# EAGLE design PoE_Atmega (EAGLE 8.3.1)
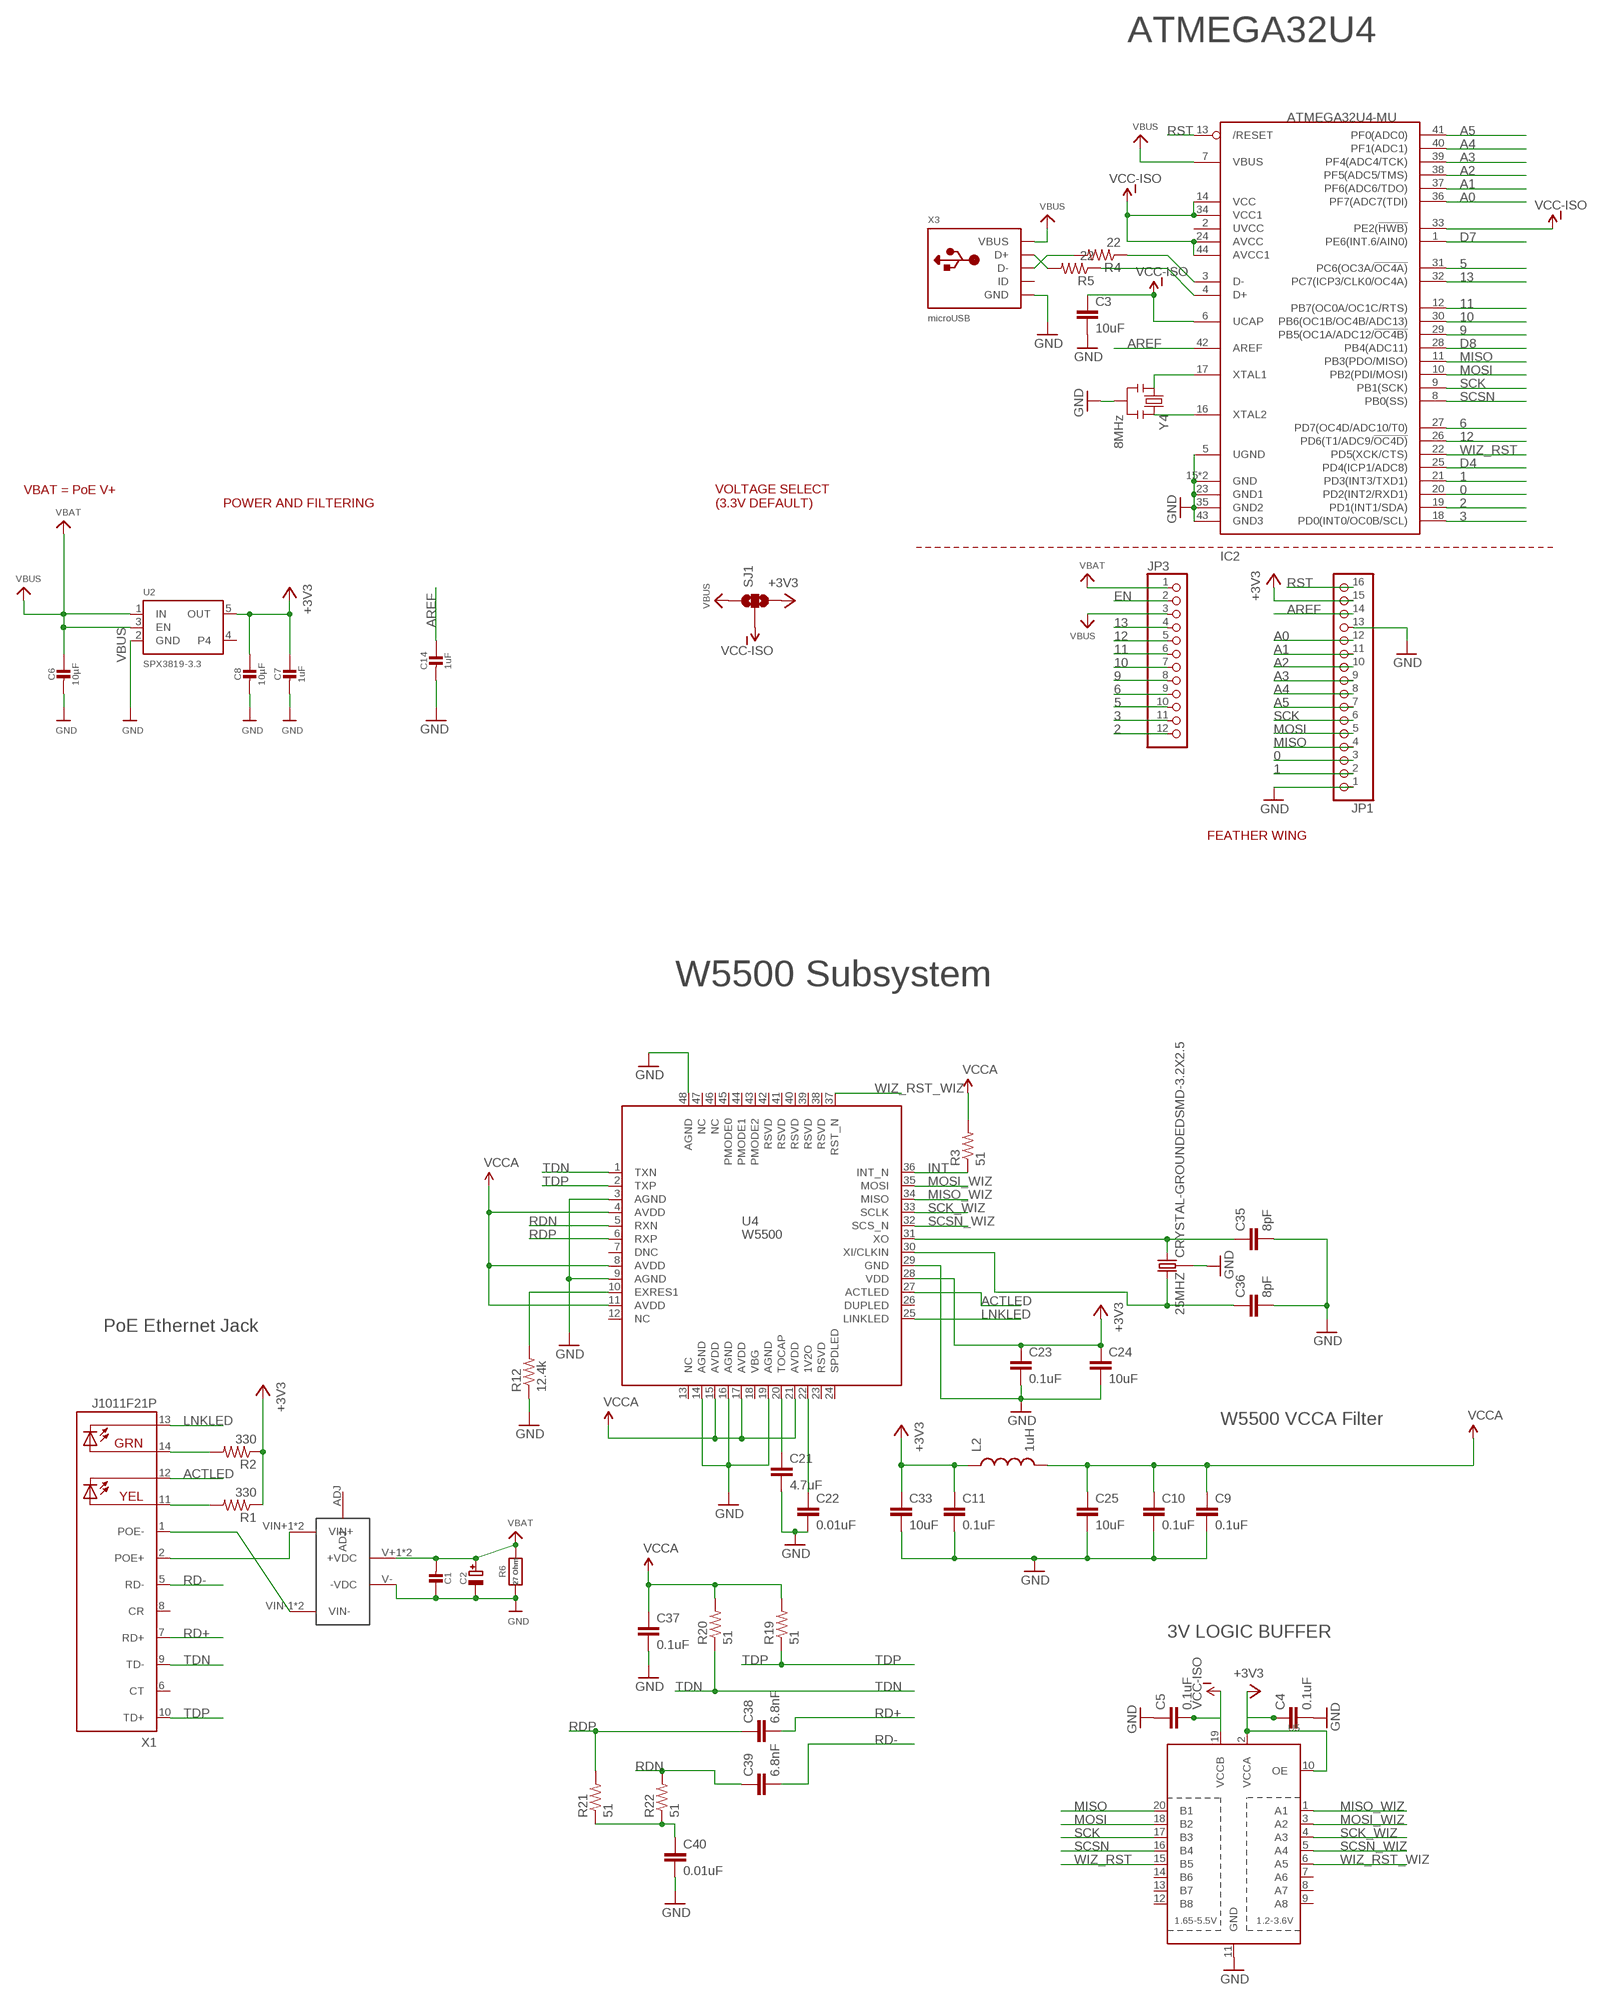
[diagram p0: schematic, sheet 1, part 1 of 2]
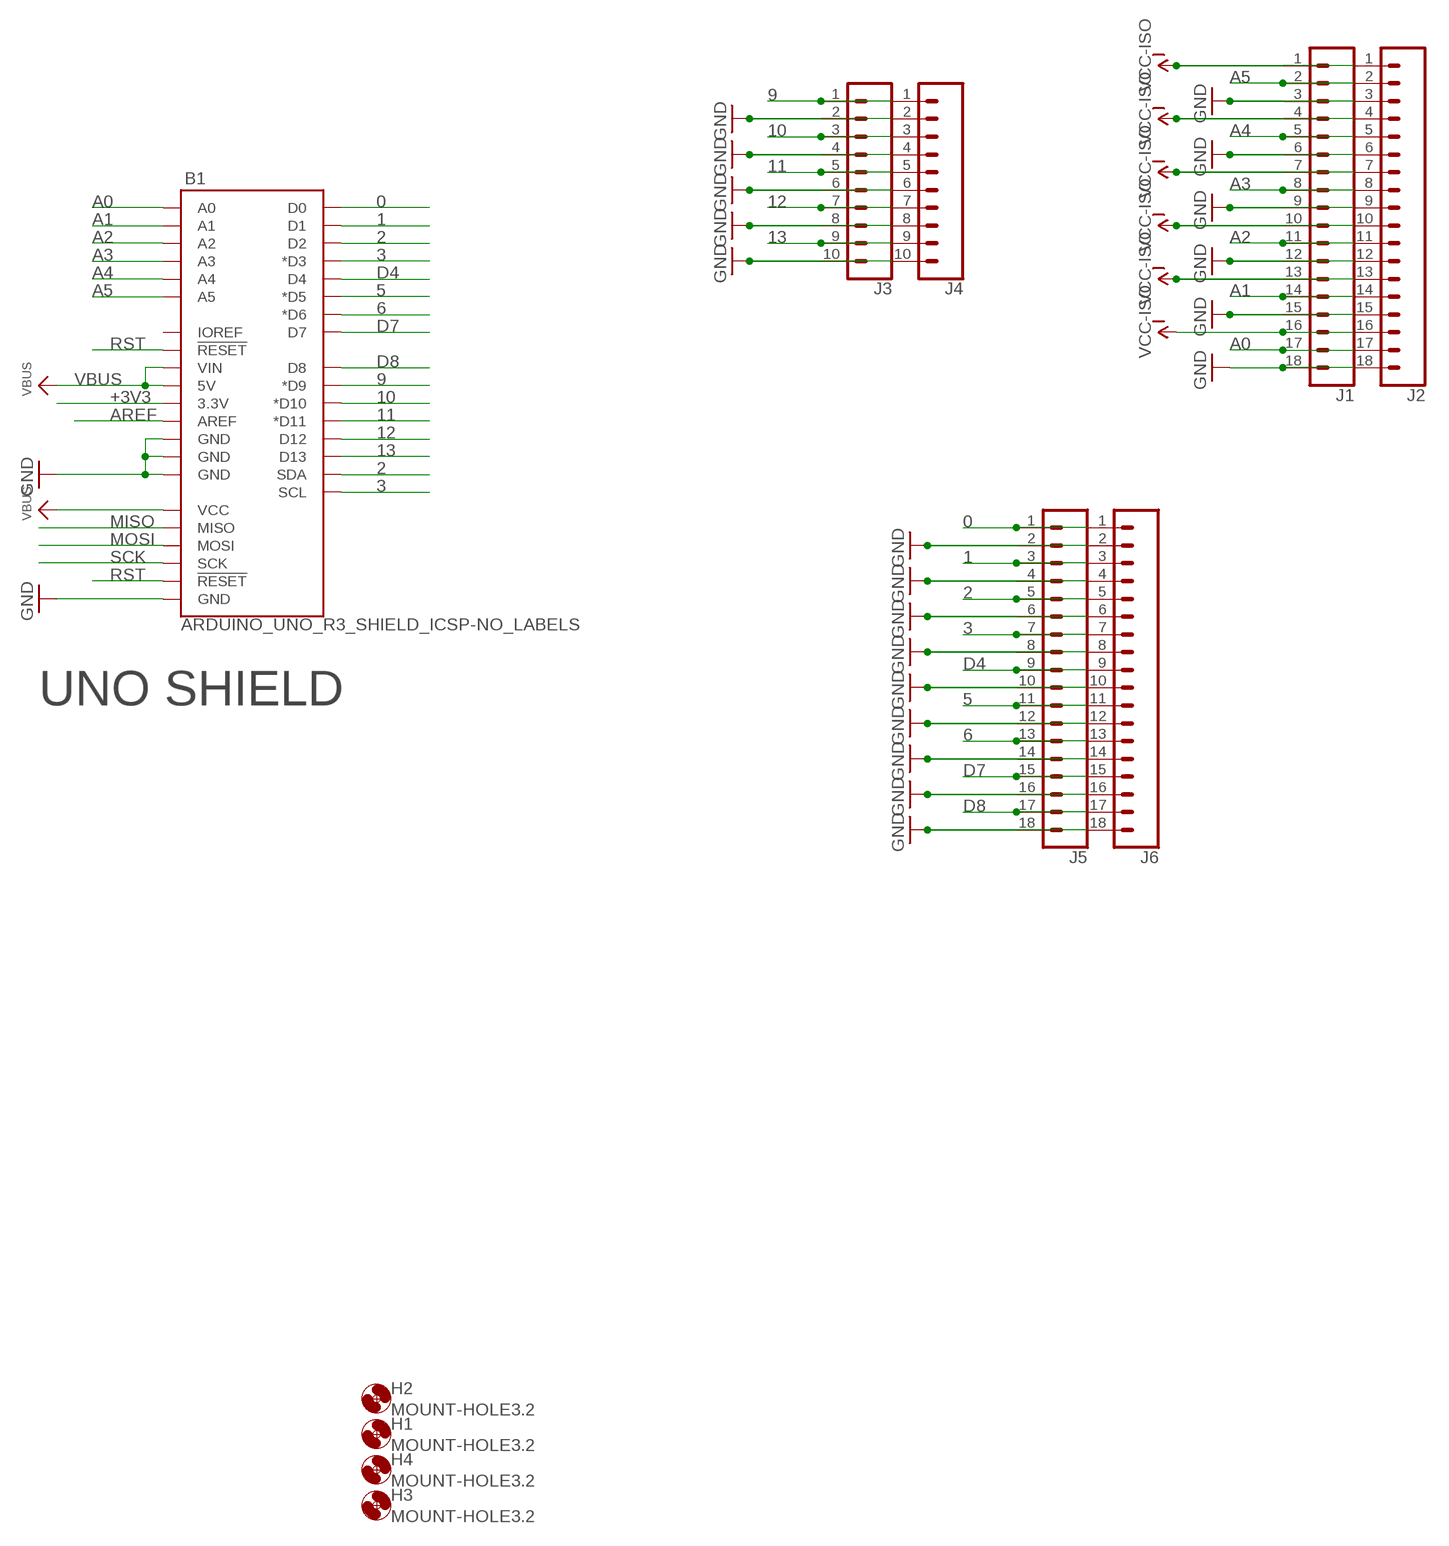
[diagram p1: schematic, sheet 1, part 2 of 2]

## Parts
25MHZ  CRYSTAL-GROUNDEDSMD-3.2X2.5  [CRYSTAL-SMD-3.2X2.5MM]
B1  ARDUINO_UNO_R3_SHIELD_ICSP-NO_LABELS  [UNO_R3_SHIELD_ICSP_NOLABELS]
C1  CAP_CERAMIC_0805MP  [_0805MP]
C2  CAP_ELECTROLYTICPANASONIC_C  [PANASONIC_C]
C3  10uF  CAP0603-CAP  [0603-CAP]
C4  0.1uF  CAP0603-CAP  [0603-CAP]
C5  0.1uF  CAP0603-CAP  [0603-CAP]
C6  10µF  CAP_CERAMIC0603MINI  [0603-MINI]
C7  1uF  CAP_CERAMIC0603MINI  [0603-MINI]
C8  10µF  CAP_CERAMIC0603MINI  [0603-MINI]
C9  0.1uF  CAP0603-CAP  [0603-CAP]
C10  0.1uF  CAP0603-CAP  [0603-CAP]
C11  0.1uF  CAP0603-CAP  [0603-CAP]
C14  1uF  CAP_CERAMIC0603_NO  [0603-NO]
C21  4.7uF  CAP0603-CAP  [0603-CAP]
C22  0.01uF  CAP0603-CAP  [0603-CAP]
C23  0.1uF  CAP0603-CAP  [0603-CAP]
C24  10uF  CAP0603-CAP  [0603-CAP]
C25  10uF  CAP0603-CAP  [0603-CAP]
C33  10uF  CAP0603-CAP  [0603-CAP]
C35  8pF  CAP0603-CAP  [0603-CAP]
C36  8pF  CAP0603-CAP  [0603-CAP]
C37  0.1uF  CAP0603-CAP  [0603-CAP]
C38  6.8nF  CAP0603-CAP  [0603-CAP]
C39  6.8nF  CAP0603-CAP  [0603-CAP]
C40  0.01uF  CAP0603-CAP  [0603-CAP]
H1  MOUNT-HOLE3.2  [3,2]
H2  MOUNT-HOLE3.2  [3,2]
H3  MOUNT-HOLE3.2  [3,2]
H4  MOUNT-HOLE3.2  [3,2]
IC2  ATMEGA32U4-MU  [TQFN44_7MM]
J1  CONN_18  [1X18]
J2  CONN_18  [1X18]
J3  CONN_10"  [1X10]
J4  CONN_10"  [1X10]
J5  CONN_18  [1X18]
J6  CONN_18  [1X18]
JP1  HEADER-1X16ROUND  [1X16_ROUND]
JP3  HEADER-1X12  [1X12_ROUND]
L2  1uH  INDUCTOR0603  [0603]
R1  330  RESISTOR0603-RES  [0603-RES]
R2  330  RESISTOR0603-RES  [0603-RES]
R3  51  RESISTOR0603-RES  [0603-RES]
R4  22  RESISTOR0603-RES  [0603-RES]
R5  22  RESISTOR0603-RES  [0603-RES]
R6  27 Ohm  RESISTOR2512  [2512]
R12  12.4k  RESISTOR0603-RES  [0603-RES]
R19  51  RESISTOR0603-RES  [0603-RES]
R20  51  RESISTOR0603-RES  [0603-RES]
R21  51  RESISTOR0603-RES  [0603-RES]
R22  51  RESISTOR0603-RES  [0603-RES]
SJ1  SOLDERJUMPER_2WAYPASTE2&3  [SJ_3_PASTE2&3]
U2  SPX3819-3.3  VREG_SOT23-5  [SOT23-5]
U4  W5500  [W5500]
U5  TXB0108PWR  [TSSOP20]
U$1  SILVERTEL_POEMICRO  [AG9900]
X1  J1011F21P  [J1]
X3  microUSB  USB_MICRO_20329_V2  [4UCONN_20329_V2]
Y4  8MHz  RESONATORSMD  [RESONATOR-SMD]

## Nets
0: B1.RX(D0) IC2.20(PD2(INT2/RXD1)) J5.1 J6.1 JP1.3
1: B1.TX(D1) IC2.21(PD3(INT3/TXD1)) J5.3 J6.3 JP1.2
2: B1.D2 B1.SDA IC2.19(PD1(INT1/SDA)) J5.5 J6.5 JP3.12
3: B1.D3(*D3) B1.SCL IC2.18(PD0(INT0/OC0B/SCL)) J5.7 J6.7 JP3.11
5: B1.D5(*D5) IC2.31(PC6(OC3A/!OC4A)) J5.11 J6.11 JP3.10
6: B1.D6(*D6) IC2.27(PD7(OC4D/ADC10/T0)) J5.13 J6.13 JP3.9
9: B1.D9(*D9) IC2.29(PB5(OC1A/ADC12/!OC4B)) J3.1 J4.1 JP3.8
10: B1.D10(*D10) IC2.30(PB6(OC1B/OC4B/ADC13)) J3.3 J4.3 JP3.7
11: B1.D11(*D11) IC2.12(PB7(OC0A/OC1C/RTS)) J3.5 J4.5 JP3.6
12: B1.D12 IC2.26(PD6(T1/ADC9/!OC4D)) J3.7 J4.7 JP3.5
13: B1.D13 IC2.32(PC7(ICP3/CLK0/OC4A)) J3.9 J4.9 JP3.4
+3V3: B1.3.3V C4.1 C7.1 C8.1 C11.1 C23.1 C24.1 C33.1 JP1.15 L2.1 R1.1 R2.1 SJ1.3 U2.5(OUT) U4.28(VDD) U5.2(VCCA) U5.10(OE)
A0: B1.A0 IC2.36(PF7(ADC7(TDI)) J1.17 J2.17 JP1.12
A1: B1.A1 IC2.37(PF6(ADC6/TDO)) J1.14 J2.14 JP1.11
A2: B1.A2 IC2.38(PF5(ADC5/TMS)) J1.11 J2.11 JP1.10
A3: B1.A3 IC2.39(PF4(ADC4/TCK)) J1.8 J2.8 JP1.9
A4: B1.A4 IC2.40(PF1(ADC1)) J1.5 J2.5 JP1.8
A5: B1.A5 IC2.41(PF0(ADC0)) J1.2 J2.2 JP1.7
ACTLED: U4.27(ACTLED) X1.12(YEL-C)
AREF: B1.AREF C14.1 IC2.42(AREF) JP1.14
D4: B1.D4 IC2.25(PD4(ICP1/ADC8)) J5.9 J6.9
D7: B1.D7 IC2.1(PE6(INT.6/AIN0)) J5.15 J6.15
D8: B1.D8 IC2.28(PB4(ADC11)) J5.17 J6.17
D+: IC2.4(D+) R5.1
D-: IC2.3(D-) R4.1
EN: JP3.2
GND: 25MHZ.2 25MHZ.4 B1.GND@0(GND) B1.GND@1(GND) B1.GND@2(GND) B1.GND_ICSP(GND) C1.1 C2.- C3.2 C4.2 C5.1 C6.2 C7.2 C8.2 C9.2 C10.2 C11.2 C14.2 C21.2 C22.2 C23.2 C24.2 C25.2 C33.2 C35.2 C36.2 C37.2 C40.2 IC2.5(UGND) IC2.15(GND) IC2.23(GND1) IC2.35(GND2) IC2.43(GND3) IC2.THERMAL(GND) J1.3 J1.6 J1.9 J1.12 J1.15 J1.18 J2.3 J2.6 J2.9 J2.12 J2.15 J2.18 J3.2 J3.4 J3.6 J3.8 J3.10 J4.2 J4.4 J4.6 J4.8 J4.10 J5.2 J5.4 J5.6 J5.8 J5.10 J5.12 J5.14 J5.16 J5.18 J6.2 J6.4 J6.6 J6.8 J6.10 J6.12 J6.14 J6.16 J6.18 JP1.1 JP1.13 R6.1 R12.1 U2.2(GND) U4.3(AGND) U4.9(AGND) U4.14(AGND) U4.16(AGND) U4.19(AGND) U4.29(GND) U4.48(AGND) U5.11(GND) U$1.V-(-VDC) X3.BASE@1(GND) X3.BASE@2(GND) X3.GND X3.SPRT@1(GND) X3.SPRT@2(GND) X3.SPRT@3(GND) X3.SPRT@4(GND) Y4.2
INT: R3.1 U4.36(INT_N)
LNKLED: U4.25(LINKLED) X1.13(GRN-C)
MISO: B1.MISO IC2.11(PB3(PDO/MISO)) JP1.4 U5.20(B1)
MISO_WIZ: U4.34(MISO) U5.1(A1)
MOSI: B1.MOSI IC2.10(PB2(PDI/MOSI)) JP1.5 U5.18(B2)
MOSI_WIZ: U4.35(MOSI) U5.3(A2)
N$1: U$1.VIN-1(VIN-) U$1.VIN-2(VIN-) X1.1(POE-)
N$2: U$1.VIN+1(VIN+) U$1.VIN+2(VIN+) X1.2(POE+)
N$6: R5.2 X3.D+
N$9: R1.2 X1.11(YEL-A)
N$10: R2.2 X1.14(GRN-A)
N$11: IC2.16(XTAL2) Y4.3
N$12: IC2.17(XTAL1) Y4.1
N$13: R4.2 X3.D-
N$18: C21.1 U4.20(TOCAP)
N$19: C22.1 U4.22(1V2O)
N$20: R12.2 U4.10(EXRES1)
N$23: C40.1 R21.1 R22.1
N$25: 25MHZ.3 C35.1 U4.31(XO)
N$26: 25MHZ.1 C36.1 U4.30(XI/CLKIN)
RD+: C38.2 X1.7(RD+)
RD-: C39.2 X1.5(RD-)
RDN: C39.1 R22.2 U4.5(RXN)
RDP: C38.1 R21.2 U4.6(RXP)
RST: B1.RES(!RESET!) B1.RST_ICSP(!RESET!) IC2.13(/RESET) JP1.16
SCK: B1.SCK IC2.9(PB1(SCK)) JP1.6 U5.17(B3)
SCK_WIZ: U4.33(SCLK) U5.4(A3)
SCSN: IC2.8(PB0(SS)) U5.16(B4)
SCSN_WIZ: U4.32(SCS_N) U5.5(A4)
TDN: R20.1 U4.1(TXN) X1.9(TD-)
TDP: R19.1 U4.2(TXP) X1.10(TD+)
VBAT: JP3.1
VBUS: B1.5V B1.5V_ICSP(VCC) B1.VIN C1.2 C2.+ C6.1 IC2.7(VBUS) JP3.3 R6.2 SJ1.1 U2.1(IN) U2.3(EN) U$1.V+1(+VDC) U$1.V+2(+VDC) X3.VBUS ; supply symbol labelled VBAT
VCC-ISO: C3.1 C5.2 IC2.6(UCAP) IC2.14(VCC) IC2.24(AVCC) IC2.33(PE2(!HWB)) IC2.34(VCC1) IC2.44(AVCC1) J1.1 J1.4 J1.7 J1.10 J1.13 J1.16 J2.1 J2.4 J2.7 J2.10 J2.13 J2.16 SJ1.2 U5.19(VCCB)
VCCA: C9.1 C10.1 C25.1 C37.1 L2.2 R3.2 R19.2 R20.2 U4.4(AVDD) U4.8(AVDD) U4.11(AVDD) U4.15(AVDD) U4.17(AVDD) U4.21(AVDD)
WIZ_RST: IC2.22(PD5(XCK/CTS)) U5.15(B5)
WIZ_RST_WIZ: U4.37(RST_N) U5.6(A5)
Unconnected: B1.IOREF IC2.2(UVCC) U2.4 U4.7(DNC) U4.12(NC) U4.13(NC) U4.18(VBG) U4.23(RSVD) U4.24(SPDLED) U4.26(DUPLED) U4.38(RSVD) U4.39(RSVD) U4.40(RSVD) U4.41(RSVD) U4.42(RSVD) U4.43(PMODE2) U4.44(PMODE1) U4.45(PMODE0) U4.46(NC) U4.47(NC) U5.7(A6) U5.8(A7) U5.9(A8) U5.12(B8) U5.13(B7) U5.14(B6) U$1.ADJ X1.6(CT) X1.8(CR) X3.ID

## Notes on the sheet
- ATMEGA32U4
- VBAT = PoE V+
- POWER AND FILTERING
- VOLTAGE SELECT
  (3.3V DEFAULT)
- UNO SHIELD
- FEATHER WING
- W5500 Subsystem
- PoE Ethernet Jack
- W5500 VCCA Filter
- 3V LOGIC BUFFER

## Library data of the parts
25MHZ = SparkFun-Clocks:CRYSTAL-GROUNDED: Crystals w/ Ground Pin (Generic) These are passive quartz crystals, which can be used as a clock source for a microcontroller. Crystal's are usually two-terminal devices. A third terminal may be optionally connected to ground, as recommended by the manufaturer.
B1 = SparkFun-Boards:ARDUINO_UNO_R3_SHIELD_ICSP: Arduino R3 Shield Footprint with ICSP Header Includes pins for 6-pin (2x3) ICSP Header. Compatible with Leonardo boards that require SPI pin connections via this header. SparkFun Products: CryptoShield <https://www.sparkfun.com/products/13183> microSD Shield <https://www.sparkfun.com/products/12761> R3 Stackable Headers Kit <https://www.sparkfun.com/products/1417>
C1 C6-C8 C14 = microbuilder:CAP_CERAMIC: Ceramic Capacitors For new designs, use the packages preceded by an '_' character since they are more reliable: The following footprints should be used on most boards: _0402 - Standard footprint for regular board layouts _0603 - Standard footprint for regular board layouts _0805 - Standard footprint for regular board layouts _1206 - Standard footprint for regular board layouts For extremely tight-pitch boards where space is at a premium, the following 'micro-pitch' footprints can be used (smaller pads, no silkscreen outline, etc.): _0402MP - Micro-pitch footprint for very dense/compact boards _0603MP - Micro-pitch footprint for very dense/compact boards _0805MP - Micro-pitch footprint for very dense/compact boards _1206MP - Micro-pitch footprint for very dense/compact boards
C2 = microbuilder:CAP_ELECTROLYTIC: Electrolytic Capacitors SMT PANASONIC_C - Size C Panasonic Electrolytic Aluminum Capacitor 47µF 16V 20% Electrolytic Capacitor [Digikey: PCE3890TR-ND] PANASONIC_D - Size D Panasonic Electrolytic Aluminum Capacitor 100µF 25V 20% Electrolytic Capacitor [Digikey: PCE3898TR-ND] PTH 3.5 mm grid, 8 mm diameter ... 3.5 mm grid, 10 mm diameter ...
C3-C5 C9-C11 C21-C25 C33 C35-C40 = SparkFun-Passives:CAP: Capacitor Standard 0603 ceramic capacitor, and 0.1" leaded capacitor.
H1-H4 = holes:MOUNT-HOLE: MOUNTING HOLE with drill center marker
IC2 = microbuilder:ATMEGA32U4: http://www.ladyada.net/library/eagle
J1 J2 J5 J6 = SparkFun-Connectors:CONN_18: Multi connection point. Often used as Generic Header-pin footprint for 0.1 inch spaced/style header connections On any of the 0.1 inch spaced packages, you can populate with these: Break Away Headers - Straight <https://www.sparkfun.com/products/116> (PRT-00116) Break Away Male Headers - Right Angle <https://www.sparkfun.com/products/553> (PRT-00553) Female Headers <https://www.sparkfun.com/products/115> (PRT-00115) Break Away Headers - Machine Pin <https://www.sparkfun.com/products/117> (PRT-00117) Break Away Female Headers - Swiss Machine Pin <https://www.sparkfun.com/products/743> (PRT-00743) For SCREWTERMINALS and SPRING TERMINALS visit here: Screw Terimnals on SparkFun.com <https://www.sparkfun.com/search/results?term=Screw+Terminals> (5mm/3.5mm/2.54mm spacing) This device is also useful as a general connection point to wire up your design to another part of your project. Our various solder wires solder well into these plated through hole pads. Hook-Up Wire - Assortment (Stranded, 22 AWG) <https://www.sparkfun.com/products/11375> (PRT-11375) Hook-Up Wire - Assortment (Solid Core, 22 AWG) <https://www.sparkfun.com/products/11367> (PRT-11367) View the entire wire category on our website here <https://www.sparkfun.com/categories/141> Special notes: Molex polarized connector foot print use with SKU : PRT-08231 with associated crimp pins and housings. 1MM SMD Version SKU: PRT-10208 NOTES ON THE VARIANTS LOCK and LOCK_LONGPADS... This footprint was designed to help hold the alignment of a through-hole component (i.e. 6-pin header) while soldering it into place. You may notice that each hole has been shifted either up or down by 0.005 of an inch from it's more standard position (which is a perfectly straight line). This slight alteration caused the pins (the squares in the middle) to touch the edges of the holes. Because they are alternating, it causes a "brace" to hold the component in place. 0.005 has proven to be the perfect amount of "off-center" position when using our standard breakaway headers. Although looks a little odd when you look at the bare footprint, once you have a header in there, the alteration is very hard to notice. Also,if you push a header all the way into place, it is covered up entirely on the bottom side.
J3 J4 = SparkFun-Connectors:CONN_10: Multi connection point. Often used as Generic Header-pin footprint for 0.1 inch spaced/style header connections On any of the 0.1 inch spaced packages, you can populate with these: Break Away Headers - Straight <https://www.sparkfun.com/products/116> (PRT-00116) Break Away Male Headers - Right Angle <https://www.sparkfun.com/products/553> (PRT-00553) Female Headers <https://www.sparkfun.com/products/115> (PRT-00115) Break Away Headers - Machine Pin <https://www.sparkfun.com/products/117> (PRT-00117) Break Away Female Headers - Swiss Machine Pin <https://www.sparkfun.com/products/743> (PRT-00743) Arduino Stackable Header - 10 Pin <https://www.sparkfun.com/products/11376> (PRT-11376) For SCREWTERMINALS and SPRING TERMINALS visit here: Screw Terimnals on SparkFun.com <https://www.sparkfun.com/search/results?term=Screw+Terminals> (5mm/3.5mm/2.54mm spacing) This device is also useful as a general connection point to wire up your design to another part of your project. Our various solder wires solder well into these plated through hole pads. Hook-Up Wire - Assortment (Stranded, 22 AWG) <https://www.sparkfun.com/products/11375> (PRT-11375) Hook-Up Wire - Assortment (Solid Core, 22 AWG) <https://www.sparkfun.com/products/11367> (PRT-11367) View the entire wire category on our website here <https://www.sparkfun.com/categories/141> Special notes: Molex polarized connector foot print use with SKU : PRT-08231 with associated crimp pins and housings. 1MM SMD Version SKU: PRT-10208 NOTES ON THE VARIANTS LOCK and LOCK_LONGPADS... This footprint was designed to help hold the alignment of a through-hole component (i.e. 6-pin header) while soldering it into place. You may notice that each hole has been shifted either up or down by 0.005 of an inch from it's more standard position (which is a perfectly straight line). This slight alteration caused the pins (the squares in the middle) to touch the edges of the holes. Because they are alternating, it causes a "brace" to hold the component in place. 0.005 has proven to be the perfect amount of "off-center" position when using our standard breakaway headers. Although looks a little odd when you look at the bare footprint, once you have a header in there, the alteration is very hard to notice. Also,if you push a header all the way into place, it is covered up entirely on the bottom side.; PROD_ID: CONN-11563
JP1 = microbuilder:HEADER-1X16: PIN HEADER
JP3 = microbuilder:HEADER-1X12
L2 = SparkFun-Passives:INDUCTOR: Inductors Basic Inductor/Choke - 0603 and 1206. Footprints are not proven and vary greatly between part numbers. INDUCTOR POWER 3.3UH 4.0A SMD 0.197" L x 0.197" W x 0.177" H (5.00mm x 5.00mm x 4.50mm)
R1-R5 R12 R19-R22 = SparkFun-Passives:RESISTOR: Resistor Basic schematic elements and footprints for 0603, 1206, and PTH resistors.
R6 = microbuilder:RESISTOR: Resistors For new designs, use the packages preceded by an '_' character since they are more reliable: The following footprints should be used on most boards: _0402 - Standard footprint for regular board layouts _0603 - Standard footprint for regular board layouts _0805 - Standard footprint for regular board layouts _1206 - Standard footprint for regular board layouts For extremely tight-pitch boards where space is at a premium, the following 'micro-pitch' footprints can be used (smaller pads, no silkscreen outline, etc.): _0402MP - Micro-pitch footprint for very dense/compact boards _0603MP - Micro-pitch footprint for very dense/compact boards _0805MP - Micro-pitch footprint for very dense/compact boards _1206MP - Micro-pitch footprint for very dense/compact boards
SJ1 = SparkFun-Retired:SOLDERJUMPER_2WAY: Solder Jumper 2 way solder jumper
U2 = microbuilder:VREG_SOT23-5: SOT23-5 Fixed Voltage Regulators Part Current Out V Out V In V Dropout θJA (°C/W) TJ (°C) Digikey Part No. ADP121 150mA 3.3V 3.4-5.5V 0.09V @ 150mA -- -- ADP121-AUJZ33R7CT-ND ADP121 150mA 3.0V 3.1-5.5V 0.09V @ 150mA -- -- ADP121-AUJZ30R7CT-ND ADP122 300mA 3.3V 3.4-5.5V 0.085V @ 300mA -- -- ADP122AUJZ-3.3-R7CT-ND ADP1712 300mA 3.3V 3.5-5.5V 0.17V @ 300mA -- -- ADP1712AUJZ-3.3-R7TR-ND AP7311 (Low Cost) 150mA 3.3V 3.5-6V 0.15V @ 150mA -- -- AP7311-33WG-7DICT-ND LD39015M18R 150mA 1.8V 1.9V-5.5V 0.08V @ 100mA -- -- 497-6977-1-ND LP2985A-33DBVR 150mA 3.3V 3.3-16V 0.28V @ 150mA 206 150 296-18479-1-ND MCP1824T-3302E/OT 300mA 3.3V 3.5V-6V 0.2V @ 300mA -- -- MCP1824T-3302E/OTCT-ND MIC5205-2.5YM5 TR 150mA 2.5V 2.7-16V 0.165V @ 150mA -- -- 576-1257-2-ND MIC5205-3.0YM5 TR 150mA 3.0V 3.2V-16V 0.165V @ 150mA -- -- 576-1258-2-ND MIC5205-3.3YM5 TR 150mA 3.3V 3.5V-16V 0.165V @ 150mA -- -- 576-1259-2-ND TPS780330220 150mA 3.3V+2.2V 3.6-5.5V 250mV Max -- -- 296-23332-1-ND TDA3663/N1,135 100mA 3.3V 3.5-45V 0.18V @ 50mA -- -- 568-5343-1-ND Max operating temp can be calculated using θJA, TJ (max junction temperature), and power in watts. Set the "Maximum Ambient Temperature" until it reaches TJ ("Max Junction Temperature"), which is the absolute limit for safe use of the regulator: Heat Sink Temperature Calculator <http://www.daycounter.com/Calculators/Heat-Sink-Temperature-Calculator.phtml> For example, With 12V source into a 3.3V LP2985 and a 30mA load, we are dissipating (12V-3.3V) * 0.03A = 0.261W. With a θJA of 206 °C/W, a TJ of 150°C, and 261mW we can safely use the chip without a heat sink up to 75°C (=147.1°C Junction Temperature).
U4 = W5500:W5500
U5 = adafruit:TXB0108PWR: 8-Bit Bi-Directional Level Shifter 1.2V-3.6V (VCCA) to 1.65V-5.5V (VCCB) bi-directional level shifter with auto direction sensing. Max data rate - VCCA 1.8V: 20Mbps (50ns), VCCA 3.3V: 100Mbps (10ns) Digikey: 296-21527-1-ND
U$1 = Heep:SILVERTEL_POE
X1 = Heep:J1011F: PULSEJACK (TM) 1x1 Tab-UP RJ45 10/100 Base-TX RJ45 1x1 Tab-UP with LEDs 8-pin (J1 series) and 6-pin (JP series) integrated magnetics connector, designed to support applications, such as ADSL modems, LAN-on-Motherboard, and Hub and Switches. Source: www.pulseeng.com .. PulseJack-J402.pdf; OC_FARNELL: unknown; OC_NEWARK: unknown
X3 = microbuilder:USB: USB Connectors USBMINIB - Surface Mount Female Mini-B USB Connector 4UConnector: 06564
Y4 = SparkFun:RESONATOR: Resonator Small SMD resonator. This is the itty bitty 10/20MHz resonators with built in caps. CSTCE10M0G55 and CSTCE20M0V53. Footprint has been reviewed closely but hasn't been tested yet.

## Board
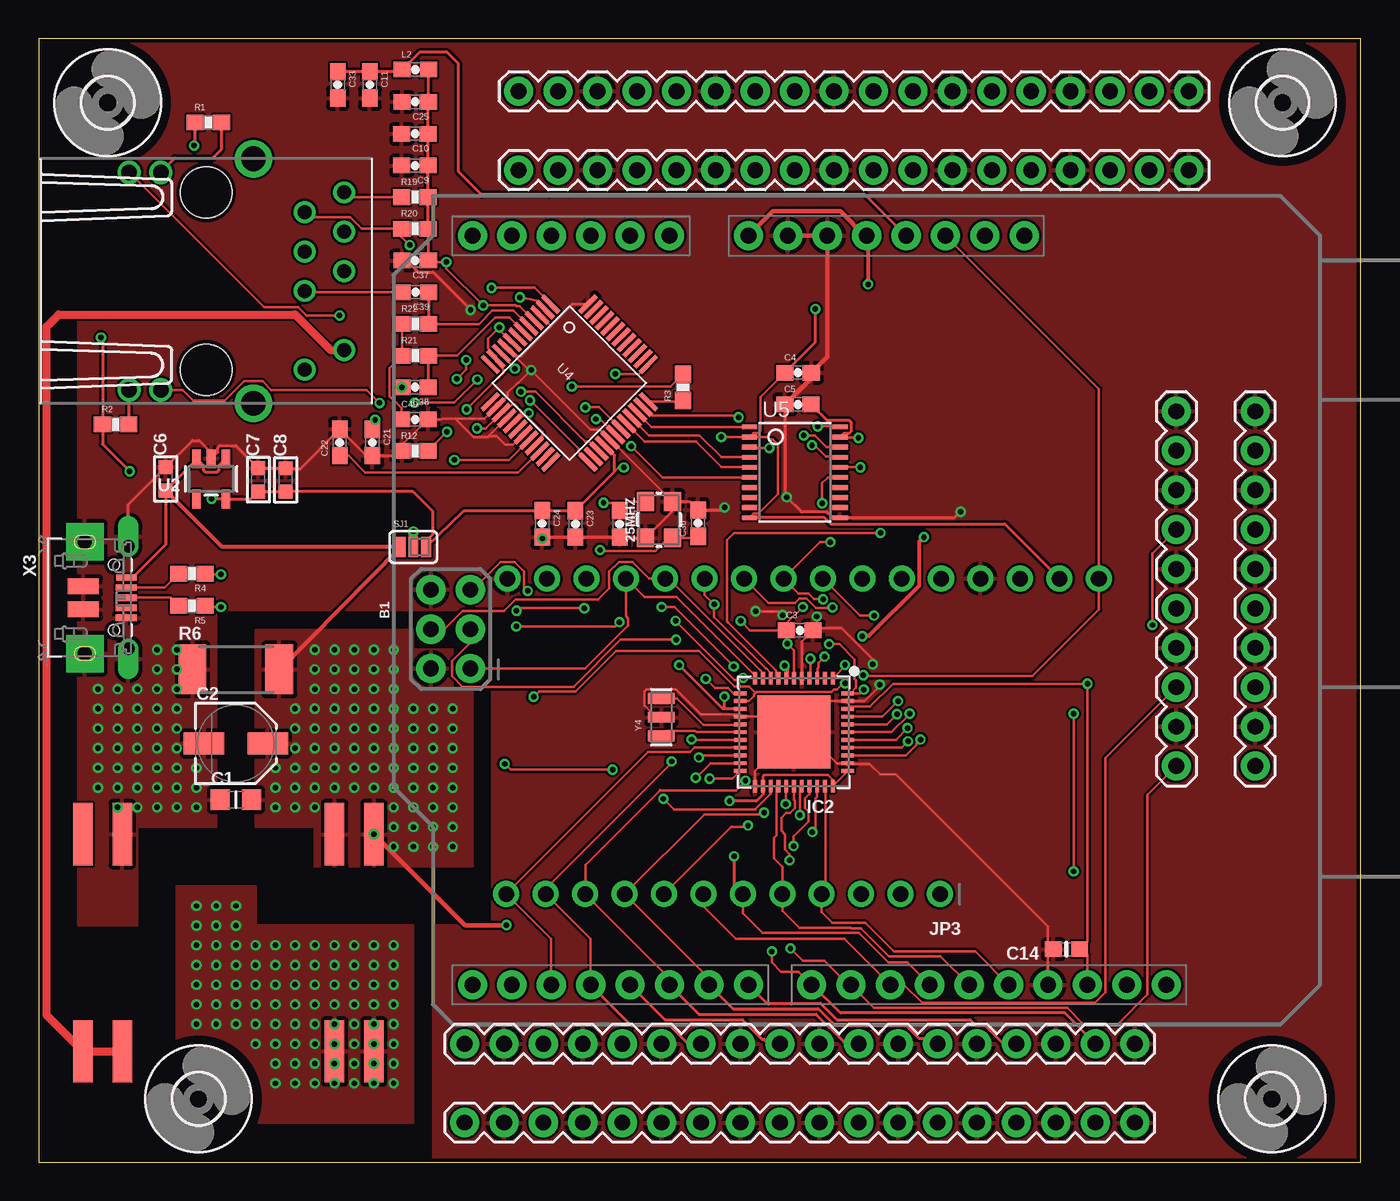
[diagram p2: board, top side]
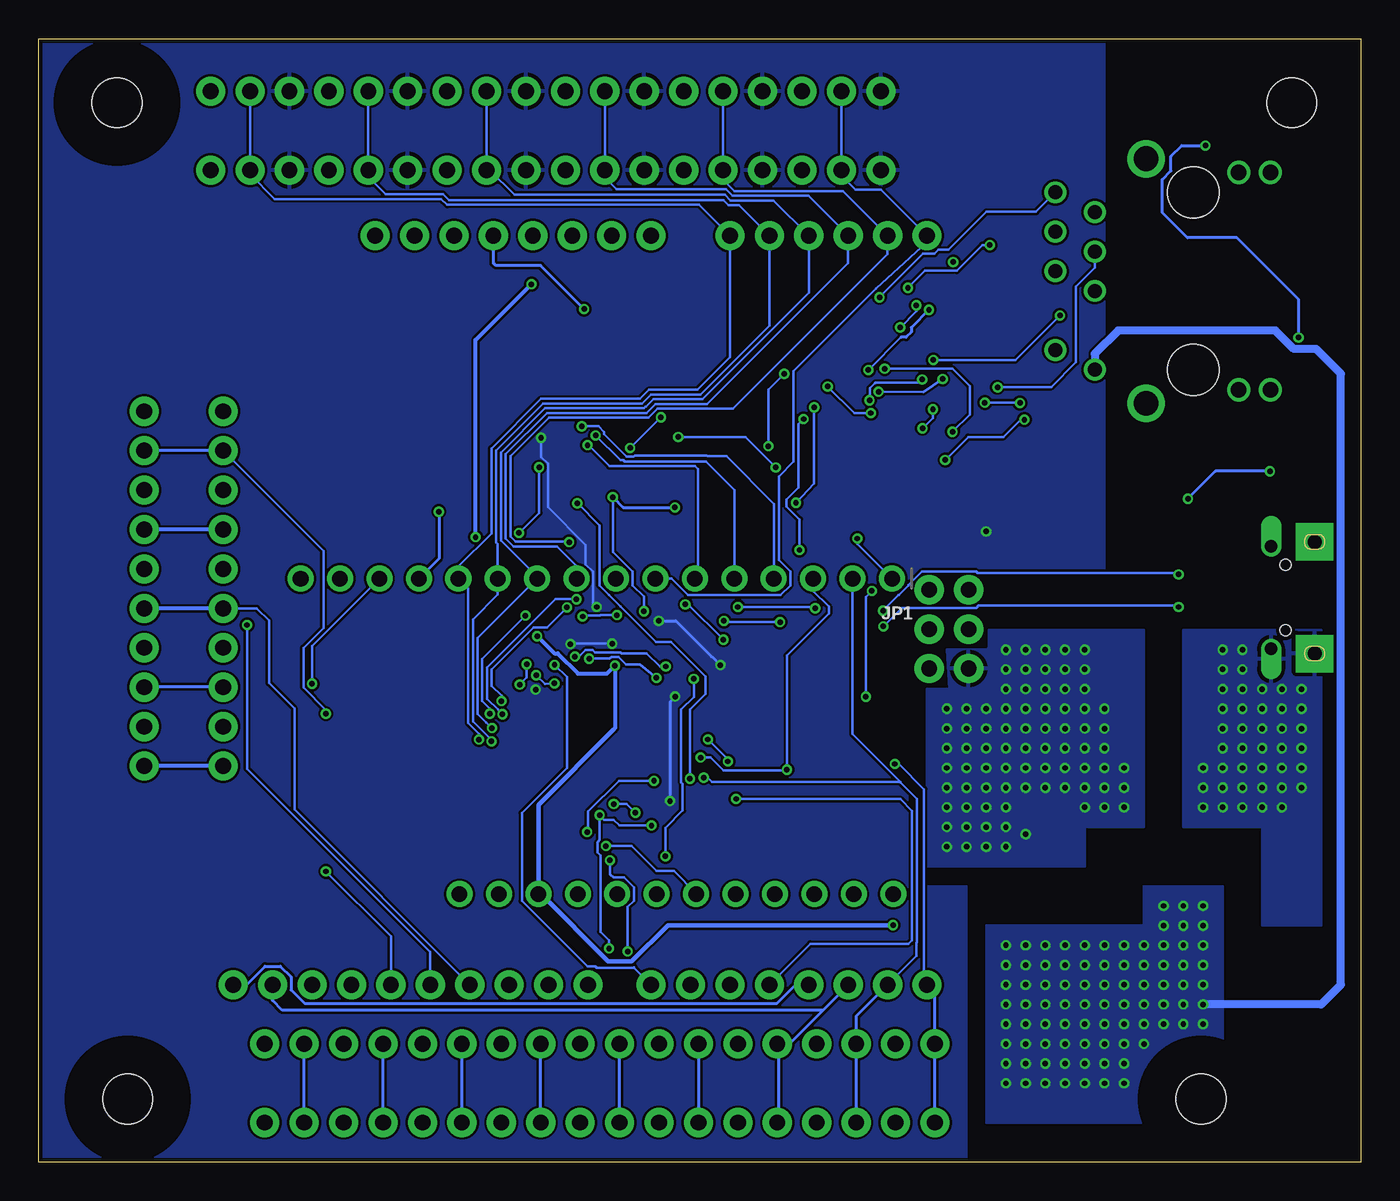
[diagram p3: board, bottom side, seen from below]

Size 85.17 x 72.38 mm. Coordinates in mm from the lower left corner, seen from the top.
Outline: 0,0 85.17,0 85.17,72.38 0,72.38 0,0
Copper layers (1*16): Top 0.035mm / dielectric 1.5mm / Bottom 0.035mm
Design rules "SeeedStudio_2layer_DRU_no_angle_20140221": minimum track width 6mil, minimum drill 12mil, track to track 6mil, track to pad 6mil, pad to pad 6mil, via to via 6mil, smd to smd 0mil, copper to edge 10mil, drill to drill 10mil, minimum pad ring 10mil, minimum via ring 6mil, stop-mask expansion 2mil, vias tented up to drill 100mil, thermal gap 10mil

### Footprints (pad centres in the part's own frame; a part is rotated, then mirrored left to right if it is on the bottom)
CRYSTAL-SMD-3.2X2.5MM = smd 1.2 x 1.1: 1 -1.175,-0.875; 2 1.175,-0.875; 3 1.175,0.875; 4 -1.175,0.875
UNO_R3_SHIELD_ICSP_NOLABELS = drill 1.016 pad 1.88: 3.3V 24.13,-3.81; 5V 24.13,-1.27; 5V_ICSP -3.76,26.81; A0 24.13,11.43; A1 24.13,13.97; A2 24.13,16.51; A3 24.13,19.05; A4 24.13,21.59; A5 24.13,24.13; AREF -24.13,-15.494; D2 -24.13,19.05; D3 -24.13,16.51; D4 -24.13,13.97; D5 -24.13,11.43; D6 -24.13,8.89; D7 -24.13,6.35; D8 -24.13,2.286; D9 -24.13,-0.254; D10 -24.13,-2.794; D11 -24.13,-5.334; D12 -24.13,-7.874; D13 -24.13,-10.414; GND@0 24.13,1.27; GND@1 24.13,3.81; GND@2 -24.13,-12.954; GND_ICSP 1.32,26.81; IOREF 24.13,-8.89; MISO -3.76,24.27; MOSI -1.22,26.81; NC 24.13,-11.43; RES 24.13,-6.35; RST_ICSP 1.32,24.27; RX -24.13,24.13; SCK -1.22,24.27; SCL -24.13,-20.574; SDA -24.13,-18.034; TX -24.13,21.59; VIN 24.13,6.35
_0805MP = smd 1.2 x 1.3: 1 -1.016,0; 2 1.016,0
PANASONIC_C = smd 2.6 x 1.4: + 2.05,0; - -2.05,0
0603-CAP = smd 1.1 x 1: 1 -0.85,0; 2 0.85,0
0603-MINI = smd 0.9 x 0.9: 1 -0.75,0; 2 0.75,0
0603-NO = smd 1.075 x 1: 1 -0.85,0; 2 0.85,0
3,2 = hole 3.2: 0,0
TQFN44_7MM = smd 0.25 x 0.8: 1 -2.5,-3.475; 2 -2,-3.475; 3 -1.5,-3.475; 4 -1,-3.475; 5 -0.5,-3.475; 6 0,-3.475; 7 0.5,-3.475; 8 1,-3.475; 9 1.5,-3.475; 10 2,-3.475; 11 2.5,-3.475; 23 2.5,3.475; 24 2,3.475; 25 1.5,3.475; 26 1,3.475; 27 0.5,3.475; 28 0,3.475; 29 -0.5,3.475; 30 -1,3.475; 31 -1.5,3.475; 32 -2,3.475; 33 -2.5,3.475 | smd 0.8 x 0.25: 12 3.475,-2.5; 13 3.475,-2; 14 3.475,-1.5; 15 3.475,-1; 16 3.475,-0.5; 17 3.475,0; 18 3.475,0.5; 19 3.475,1; 20 3.475,1.5; 21 3.475,2; 22 3.475,2.5; 34 -3.475,2.5; 35 -3.475,2; 36 -3.475,1.5; 37 -3.475,1; 38 -3.475,0.5; 39 -3.475,0; 40 -3.475,-0.5; 41 -3.475,-1; 42 -3.475,-1.5; 43 -3.475,-2; 44 -3.475,-2.5 | smd 4.7 x 4.7: THERMAL 0,0
1X18 = drill 1.016 pad 1.88: 1 0,0; 2 2.54,0; 3 5.08,0; 4 7.62,0; 5 10.16,0; 6 12.7,0; 7 15.24,0; 8 17.78,0; 9 20.32,0; 10 22.86,0; 11 25.4,0; 12 27.94,0; 13 30.48,0; 14 33.02,0; 15 35.56,0; 16 38.1,0; 17 40.64,0; 18 43.18,0
1X10 = drill 1.016 pad 1.88: 1 0,0; 2 2.54,0; 3 5.08,0; 4 7.62,0; 5 10.16,0; 6 12.7,0; 7 15.24,0; 8 17.78,0; 9 20.32,0; 10 22.86,0
1X16_ROUND = drill 1 pad 1.676: 1 -19.05,0; 2 -16.51,0; 3 -13.97,0; 4 -11.43,0; 5 -8.89,0; 6 -6.35,0; 7 -3.81,0; 8 -1.27,0; 9 1.27,0; 10 3.81,0; 11 6.35,0; 12 8.89,0; 13 11.43,0; 14 13.97,0; 15 16.51,0; 16 19.05,0
1X12_ROUND = drill 1 pad 1.676: 1 -13.97,0; 2 -11.43,0; 3 -8.89,0; 4 -6.35,0; 5 -3.81,0; 6 -1.27,0; 7 1.27,0; 8 3.81,0; 9 6.35,0; 10 8.89,0; 11 11.43,0; 12 13.97,0
0603 = smd 1.1 x 1: 1 -0.85,0; 2 0.85,0
0603-RES = smd 1.1 x 1: 1 -0.85,0; 2 0.85,0
2512 = smd 1.8 x 3.2: 1 -2.8,0; 2 2.8,0
SJ_3_PASTE2&3 = smd 0.635 x 1.27: 1 -0.813,0; 2 0,0; 3 0.813,0
SOT23-5 = smd 0.55 x 1.2: 1 -0.95,-1.3; 2 0,-1.3; 3 0.95,-1.3; 4 0.95,1.3; 5 -0.95,1.3
W5500 = smd 1.5 x 0.3: 1 -4.45,2.75; 2 -4.45,2.25; 3 -4.45,1.75; 4 -4.45,1.25; 5 -4.45,0.75; 6 -4.45,0.25; 7 -4.45,-0.25; 8 -4.45,-0.75; 9 -4.45,-1.25; 10 -4.45,-1.75; 11 -4.45,-2.25; 12 -4.45,-2.75; 25 4.45,-2.75; 26 4.45,-2.25; 27 4.45,-1.75; 28 4.45,-1.25; 29 4.45,-0.75; 30 4.45,-0.25; 31 4.45,0.25; 32 4.45,0.75; 33 4.45,1.25; 34 4.45,1.75; 35 4.45,2.25; 36 4.45,2.75 | smd 0.3 x 1.5: 13 -2.75,-4.45; 14 -2.25,-4.45; 15 -1.75,-4.45; 16 -1.25,-4.45; 17 -0.75,-4.45; 18 -0.25,-4.45; 19 0.25,-4.45; 20 0.75,-4.45; 21 1.25,-4.45; 22 1.75,-4.45; 23 2.25,-4.45; 24 2.75,-4.45; 37 2.75,4.45; 38 2.25,4.45; 39 1.75,4.45; 40 1.25,4.45; 41 0.75,4.45; 42 0.25,4.45; 43 -0.25,4.45; 44 -0.75,4.45; 45 -1.25,4.45; 46 -1.75,4.45; 47 -2.25,4.45; 48 -2.75,4.45
TSSOP20 = smd 0.305 x 0.991: 1 -2.925,-2.918; 2 -2.275,-2.918; 3 -1.625,-2.918; 4 -0.975,-2.918; 5 -0.325,-2.918; 6 0.325,-2.918; 7 0.975,-2.918; 8 1.625,-2.918; 9 2.275,-2.918; 10 2.925,-2.918; 11 2.925,2.918; 12 2.275,2.918; 13 1.625,2.918; 14 0.975,2.918; 15 0.325,2.918; 16 -0.325,2.918; 17 -0.975,2.918; 18 -1.625,2.918; 19 -2.275,2.918; 20 -2.925,2.918
AG9900 = smd 1.25 x 4: ADJ 18.75,0; V+1 0,0; V+2 2.54,0; V- 16.21,0; VIN+1 18.75,14; VIN+2 16.21,14; VIN-1 2.54,14; VIN-2 0,14
J1 = drill 0.9 pad 1.3: 1 5.715,0; 2 4.445,2.54; 5 0.635,0; 6 -0.635,2.54; 7 -1.905,0; 8 -3.175,2.54; 9 -4.445,0; 10 -5.715,2.54 | drill 1 pad 1.422: 11 -7.01,-9.275; 12 -7.01,-11.307; 13 7.01,-9.275; 14 7.01,-11.307 | drill 1.6 pad 2.184: M1 -7.875,-3.3; M2 7.875,-3.3 | hole 3.3: 5.715,-6.35; -5.715,-6.35
4UCONN_20329_V2 = smd 1 x 2: BASE@1 -0.75,-2; BASE@2 0.75,-2 | smd 0.4 x 1.35: D+ 0,0.775; D- -0.65,0.775; GND 1.3,0.775; ID 0.65,0.775 | drill 0.8 pad 1.143 offset: SPRT@1 -3.3,0.9; SPRT@2 3.3,0.9 | drill 0.9 pad 2.413 square: SPRT@3 -3.6,-1.9; SPRT@4 3.6,-1.9 | smd 0.4 x 1.321: VBUS -1.3,0.775 | hole 0.7: -2.108,-0.025; 2.108,-0.025
RESONATOR-SMD = smd 0.7 x 1.7: 1 -1.2,0; 2 0,0; 3 1.2,0

### Placement (x,y rotation side)
25MHZ  39.95,41.39 90 top
B1  52.07,35.56 90 top
C1  12.7,23.35 0 top
C2  12.7,26.98 0 top
C3  49.04,34.26 0 top
C4  48.92,50.86 0 top
C5  48.91,48.83 0 top
C6  8.18,44.02 90 top
C7  14.15,43.97 90 top
C8  15.91,43.95 90 top
C9  24.23,64.21 180 top
C10  24.23,66.26 180 top
C11  21.33,69.42 270 top
C14  66.22,13.72 180 top
C21  21.49,46.37 270 top
C22  19.4,46.37 90 top
C23  34.57,41.12 270 top
C24  32.43,41.13 270 top
C25  24.25,68.32 180 top
C33  19.26,69.42 270 top
C35  37.42,41.12 270 top
C36  42.48,41.17 90 top
C37  24.25,58.1 180 top
C38  24.25,49.92 180 top
C39  24.26,56.06 180 top
C40  24.24,47.85 0 top
H1  80.13,68.27 0 top
H2  10.29,4.07 0 top
H3  4.45,68.27 0 top
H4  79.45,4.07 0 top
IC2  48.65,27.7 180 top
J1  30.92,69 0 top
J2  30.92,63.92 0 top
J3  78.38,25.52 90 top
J4  73.3,25.52 90 top
J5  27.43,2.55 0 top
J6  27.43,7.63 0 top
JP1  49.25,37.6 180 bottom
JP3  44.09,17.27 180 top
L2  24.26,70.39 0 top
R1  10.93,66.99 0 top
R2  4.95,47.53 0 top
R3  41.51,49.92 90 top
R4  9.87,37.93 180 top
R5  9.87,35.85 180 top
R6  12.7,31.75 0 top
R12  24.24,45.82 0 top
R19  24.24,62.18 0 top
R20  24.24,60.14 0 top
R21  24.26,51.97 0 top
R22  24.26,54.01 0 top
SJ1  24.13,39.63 0 top
U2  11.11,44.03 180 top
U4  34.18,50.2 315 top
U5  48.71,44.45 270 top
U$1  21.59,21.13 180 top
X1  17.13,56.77 270 top
X3  4.87,36.37 270 top
Y4  40.11,28.67 90 top

### Tracks (layer width: path | path; a pad name or v marks a point on that pad's centre or on a via)
0  (via drill 0.35)
  Top 0.152: v42.53,26.07 42.66,26.2 IC2.20 | v30.01,25.66 30.38,25.29 v36.97,25.29
  Bottom 0.152: B1.RX 28.13,11.62 28.13,24.02 29.77,25.66 v30.01,25.66 | v42.53,26.07 41.88,26.07 41.05,25.24 37.02,25.24 v36.97,25.29 36.97,32.64 34.27,35.34 34.27,35.8 35.28,36.81 JP1.3
  Bottom 0.2: B1.RX 27.43,10.92 27.43,7.79 | 27.43,7.79 J6.1 | J5.1 27.43,7.79
1  (via drill 0.35)
  Top 0.152: v42.33,24.77 43.26,25.7 IC2.21
  Bottom 0.152: B1.TX 28.63,13.28 28.63,14.14 28.61,14.16 28.61,23.42 29.66,24.47 | JP1.2 32.74,27.58 29.66,24.5 29.66,24.47 | 29.66,24.47 29.68,24.5 41.78,24.5 42.05,24.77 v42.33,24.77
  Bottom 0.2: B1.TX 32.51,9.4 J6.3 J5.3
2
  Top 0.152: B1.D2 33.02,14.37 JP3.12 39.26,26.41 41.95,26.41 42.24,26.7 IC2.19
  Bottom 0.2: B1.D2 34.66,9.79 | 34.66,9.79 69.48,9.79 70.1,10.41 B1.SDA | 34.66,9.79 36.82,7.63 37.48,7.63 | 37.48,7.63 J6.5 | J5.5 37.48,2.66 37.48,7.63
3  (via drill 0.35)
  Top 0.152: B1.D3 35.56,14.37 JP3.11 32.66,17.62 40.77,25.73 v40.77,25.82 | v42.06,27.23 42.16,27.2 IC2.18
  Top 0.2: B1.D3 38.17,8.82 40.62,8.82 41.82,7.63 J6.7
  Bottom 0.152: v42.06,27.23 40.77,25.95 v40.77,25.82 | 72.62,11.43 B1.SCL
  Bottom 0.2: B1.D3 36.41,11.43 37.61,10.24 68.06,10.24 68.91,11.09 68.91,11.92 69.61,12.62 70.6,12.62 71.79,11.43 B1.SCL | J6.7 J5.7
5  (via drill 0.35)
  Top 0.152: 35.22,17.25 JP3.10 | 35.22,17.25 40.64,11.83 B1.D5 | 40.03,23.97 40.02,23.96 | 40.02,23.96 35.22,19.16 35.22,17.25 | v49.84,21.27 50.03,21.41 50.03,23.43 50.13,23.54 50.13,24.21 IC2.31 | 40.02,23.96 44.92,23.96 v45.53,24.57
  Top 0.2: B1.D5 42.54,9.53 50.08,9.53 51.89,7.71 51.95,7.71 52.03,7.63 J6.11
  Bottom 0.152: v45.53,24.57 47.8,24.57 49.78,22.59 49.78,21.34 v49.84,21.27
  Bottom 0.2: J5.11 J6.11
6  (via drill 0.35)
  Top 0.152: v46.73,22.51 46.62,22.41 42.88,22.41 JP3.9 43.18,11.83 B1.D6 | IC2.27 48.15,23.1 v48.12,23.07
  Top 0.2: B1.D6 44.73,9.88 50.22,9.88 51.28,8.82 55.86,8.82 56.71,7.98 57.14,7.98 57.49,7.63 J6.13
  Bottom 0.152: v48.12,23.07 47.29,23.07 v46.73,22.51
  Bottom 0.2: J5.13 J6.13
9  (via drill 0.35)
  Top 0.152: JP3.8 44.6,21.59 45.6,21.59 v45.69,21.69 | v48.43,13.77 49.23,12.97 50.63,12.97 52.17,11.43 B1.D9 53.82,9.93 66.27,9.93 67.31,8.89 69.53,8.89 71.44,10.79 71.44,23.66 J4.1 | IC2.29 49.04,24.11 v49.04,22.36
  Bottom 0.152: v45.69,21.69 47.75,21.69 48.13,22.07 48.75,22.07 v49.04,22.36 49.04,20.75 49.19,20.6 49.19,19.97 48.99,19.77 48.99,14.84 48.43,14.29 v48.43,13.77
  Bottom 0.254: J4.1 J3.1
10  (via drill 0.35)
  Top 0.152: JP3.7 42.82,16.48 44.93,14.37 51.92,14.37 B1.D10 55.75,11.43 56.92,10.26 68.05,10.26 68.73,10.95 68.73,26.04 J4.3 | v48.63,20.37 48.63,21 49.59,21.97 49.59,22.59 49.35,22.83 49.35,23.42 49.65,23.72 IC2.30
  Bottom 0.152: v48.63,20.37 46.99,20.37 45.37,18.75 44.25,18.75 42.82,17.32 JP3.7
  Bottom 0.2: J4.3 J3.3
11  (via drill 0.35)
  Top 0.152: B1.D11 55.96,12.87 54.73,12.87 52.83,14.77 46.63,14.77 45.36,16.04 45.36,17.18 JP3.6 | IC2.12 44.75,30.2 44.4,30.55 43.55,30.55 v42.97,31.14
  Top 0.2: v44.8,19.71 44.8,17.74 45.36,17.18
  Bottom 0.152: v44.8,19.71 44.8,21.54 43.68,22.66 43.68,24.38 43.78,24.48 43.78,29.17 42.97,29.98 v42.97,31.14 | B1.D11 68.7,22.72 68.7,29.23 70.34,30.87 70.34,34.89 71.12,35.68 73.45,35.68
  Bottom 0.254: J4.5 73.45,35.68 J3.5
12  (via drill 0.35)
  Top 0.152: B1.D12 58.1,13.27 54.76,13.27 52.96,15.07 52.35,15.07 52.32,15.11 49,15.11 47.9,16.2 JP3.5 47.9,19.02 47.35,19.56 47.35,20.88 47.53,21.06 47.53,24.1 IC2.26 | v71.76,34.61 71.76,39.22 J4.7
  Bottom 0.152: B1.D12 59.94,13.54 71.76,25.35 v71.76,34.61
  Bottom 0.254: J4.7 J3.7
13  (via drill 0.35)
  Top 0.152: B1.D13 60.34,13.57 58.23,13.57 55.09,13.57 53.25,15.41 51.15,15.41 50.44,16.12 JP3.4 50.44,17.57 50.68,17.82 50.68,24.2 IC2.32 | v66.67,18.73 v66.67,28.89
  Bottom 0.152: B1.D13 62.48,14.54 v66.67,18.73 | J4.9 66.83,39.37 66.83,34.42 68.12,33.13 68.12,30.59 66.67,29.15 v66.67,28.89
  Bottom 0.2: J4.9 J3.9
+3V3  (via drill 0.35)
  Top 0.152: 36.48,46.17 U4.28 | v37.69,44.76 37.36,44.76 37.1,44.5 | U5.2 v43.97,46.72 | U5.2 46.06,46.99 46.38,46.99 46.51,47.12 46.51,49.31 C4.1 | U5.10 46.06,41.79 46.38,41.79 47.62,43.03 47.62,46.25 47.3,46.57 47.07,46.57 46.92,46.72 U5.2
  Top 0.2: v4,53.13 4.1,53.04 R2.1 4.1,47.17 | U2.5 13.65,42.73 C7.1 15.89,43.22 C8.1 24.11,43.21 25.4,41.91 25.4,40.46 24.82,39.88 SJ1.3 27.41,41.98 C24.1 32.45,41.97 C23.1 37.1,44.5 37.1,45.54 36.48,46.17 | B1.3.3V 53.22,62.35 32.92,62.35 32.9,62.33 28.54,62.33 27.04,63.83 27.04,70.77 26.3,71.5 24.52,71.5 L2.1 23.29,70.27 C11.1 | U5.10 50.62,41.52 51.02,41.12 62.24,41.12 JP1.15 | C11.1 | C11.1 C33.1 | v10,65.5 10.08,65.57 R1.1
  Top 0.203: R2.1 4.1,46.26 v5.85,44.52 | v11.13,42.74 12.04,42.74 U2.5 | C4.1 50.03,52.82 v50.03,54.97
  Bottom 0.152: v43.97,46.72 39.65,46.72 v37.69,44.76
  Bottom 0.2: v4,53.13 4,55.58 7.97,59.55 11.15,59.55 12.78,61.18 12.78,63.32 12.23,63.87 12.23,64.81 11.54,65.5 v10,65.5
  Bottom 0.203: v5.85,44.52 9.36,44.52 v11.13,42.74 | v50.03,54.97 52.83,57.77 55.73,57.77 55.88,57.92 B1.3.3V
A0  (via drill 0.35)
  Top 0.152: v56.81,27.23 56.56,26.98 56.56,26.88 55.88,26.2 IC2.36
  Bottom 0.152: v56.81,27.23 56.81,27.59 57.51,28.28 57.51,36.97 JP1.12 58.14,38.37 56,40.51 56,45.99 52.8,49.19 52.55,49.19 | 52.55,49.19 | 52.55,49.19 46.43,49.19 45.85,49.77 42.73,49.77 40.64,51.87 B1.A0 42.63,61.68 58.86,61.68 59.25,62.06 69.97,62.06 71.56,63.65 J2.17 | J2.17 | J2.17 J1.17
A1  (via drill 0.35)
  Top 0.152: v56,27.11 55.6,26.7 IC2.37
  Bottom 0.152: v56,27.11 56,27.21 57.2,28.41 57.2,34.96 55.6,36.57 JP1.11 55.6,39.83 55.7,39.93 55.7,45.86 52.68,48.88 52.42,48.88 | 52.42,48.88 | 52.42,48.88 46.31,48.88 45.72,49.47 42.54,49.47 38.1,53.91 B1.A1 40.06,61.65 40.72,61.65 41.05,61.98 58.74,61.98 59.14,62.38 62.84,62.38 63.94,63.49 J2.14 J1.14
A2  (via drill 0.35)
  Top 0.152: v55.97,27.96 55.21,27.2 IC2.38
  Bottom 0.152: 56.34,28.33 | 56.34,28.33 v55.97,27.96 | 56.34,28.33 56.9,28.89 56.9,33.76 JP1.10 53.06,37.72 55.4,40.05 55.4,45.73 52.55,48.58 46.18,48.58 46.07,48.69 46.04,48.69 45.57,49.16 42.42,49.16 35.56,56.02 B1.A2 37.83,61.96 40.59,61.96 40.96,62.33 54.53,62.33 56.12,63.92 J2.11 J1.11
A3  (via drill 0.35)
  Top 0.152: JP1.9 52.91,35.21 v53.81,35.21 | v56.11,28.89 54.93,27.7 IC2.39
  Bottom 0.152: v56.11,28.89 56.11,29.25 56.6,29.73 56.6,32.43 v53.81,35.21 | JP1.9 50.52,38.42 51.78,39.68 54.59,39.68 55.09,40.18 55.09,45.61 52.42,48.27 46.03,48.27 45.44,48.86 42.12,48.86 33.03,57.94 33.03,59.68 B1.A3 35.59,62.26 40.47,62.26 40.9,62.7 47.95,62.7 48.7,63.45 J2.8 J1.8
A4  (via drill 0.35)
  Top 0.152: v50.53,36.27 49.95,36.27 49.59,36.63 48.95,36.63 JP1.8 50.33,39.95 v51,39.95 | v55.29,28.86 54.64,28.2 IC2.40
  Bottom 0.152: v50.53,36.27 50.88,36.27 50.91,36.3 51.88,36.3 56.29,31.88 56.29,29.85 55.59,29.15 | 55.59,29.15 | 55.59,29.15 v55.29,28.86 | v51,39.95 51.03,39.98 54.46,39.98 54.79,40.31 54.79,45.48 52.3,47.97 45.9,47.97 45.32,48.55 40.44,48.55 30.5,58.5 30.5,59.67 B1.A4 33.36,62.57 40.34,62.57 41.08,63.31 41.08,64.01 | 41.08,64.01 J1.5 | 41.08,64.01 J2.5
A5  (via drill 0.35)
  Top 0.152: v51.14,35.74 50.79,35.74 50.76,35.71 50.07,35.71 49.46,36.33 49,36.33 48.71,36.03 47,36.03 JP1.7 | v55.36,29.71 54.35,28.7 IC2.41
  Bottom 0.152: v55.36,29.71 55.36,30.06 55.99,30.69 55.99,31.75 53.29,34.44 52.44,34.44 v51.14,35.74 | JP1.7 44.41,37.6 43.34,36.53 37.38,36.53 36.75,37.16 36.75,38.04 37.49,38.78 37.49,44.17 36.54,45.13 36.54,50.97 31.23,56.28 27.94,59.27 B1.A5 30.9,62.65 32.54,62.65 33.46,63.57 J2.2 J1.2
ACTLED  (via drill 0.35)
  Top 0.152: v19.38,54.55 17.25,54.55 16.71,55.09 14.51,55.09 X1.12 | v27.53,51.68 27.53,51.06 v26.93,50.46 | U4.27 35.46,46.44 35.2,46.44 32,49.64 v31.06,49.64
  Bottom 0.152: v31.06,49.64 28.17,49.62 v26.93,50.46 | v27.53,51.68 27.52,51.67 22.26,51.67 v19.38,54.55
AREF  (via drill 0.35)
  Top 0.152: IC2.42 52.28,29.35 53.55,29.35 55.02,30.82 v67.56,30.82 67.56,14.22 67.13,13.79 | 67.13,13.79 C14.1 | B1.AREF 67.56,13.36 67.13,13.79
  Bottom 0.152: v67.56,30.82 67.56,33.26 JP1.14
D4  (via drill 0.35)
  Top 0.152: IC2.25 47.15,23.72 46.17,22.74 46.17,22.71 40.94,22.71 v40.25,23.4
  Top 0.2: B1.D4 40.35,9.18 45.35,9.18 46.6,7.93 46.73,7.93 47.03,7.63 J6.9
  Bottom 0.152: B1.D4 35.46,14.07 29.13,14.07 28.91,14.29 28.91,22.64 29.67,23.4 v40.25,23.4
  Bottom 0.2: J5.9 J6.9
D7  (via drill 0.35)
  Top 0.152: IC2.1 52.03,32.05 51.95,32.05 v51.94,32.04
  Top 0.2: B1.D7 46.92,10.23 50.37,10.23 51.42,9.18 60.01,9.18 60.37,8.82 60.94,8.82 62.14,7.63 J6.15
  Bottom 0.152: v51.94,32.04 51.13,31.27 51.13,25.41 54.05,22.49 54.05,16.83 49.82,12.6 49.3,12.6 49.22,12.52 46.81,12.52 | 46.81,12.52 46.81,12.56 | 46.81,12.52 B1.D7
  Bottom 0.2: J5.15 J6.15
D8  (via drill 0.35)
  Top 0.152: B1.D8 48.94,12.27 47.83,12.27 47.23,12.87 v47.23,13.57 | IC2.28 48.65,23.35 48.72,23.28 48.72,22.82 48.39,22.5 48.15,22.5 47.83,22.18 47.83,21.36 48.07,21.12 48.07,20.14 48.37,19.84 v48.37,19.45
  Top 0.2: J6.17 66.09,9.61 51.66,9.61 49.83,11.43 B1.D8
  Bottom 0.152: v47.23,13.57 47.23,16.43 46.83,16.83 46.83,17.71 47.46,18.34 48.15,18.34 48.37,18.55 v48.37,19.45
  Bottom 0.2: J5.17 J6.17
D+  (via drill 0.35)
  Top 0.152: v41.03,34.87 44.84,31.06 45.23,31.06 arc90 v45.38,31.2 | v11.73,35.77 10.79,35.77 R5.1 | v49.71,32.44 49.71,31.23 IC2.4 | v30.75,34.52 37.13,34.52 v37.41,34.8
  Bottom 0.152: v45.38,31.2 46.44,32.07 47.34,32.07 47.82,32.55 48.28,32.55 48.39,32.44 v49.71,32.44 | v11.73,35.77 11.83,35.87 24.62,35.87 24.78,35.71 29.57,35.71 v30.75,34.52 | v37.41,34.8 40.96,34.8 v41.03,34.87
D-  (via drill 0.35)
  Top 0.152: v11.73,37.87 10.77,37.87 R4.1 | IC2.3 50.15,31.78 50.23,31.86 50.23,32.17 v50.63,32.57 | v40.13,35.77 40.94,35.77 v44.78,31.93 | v35.14,35.69 30.94,35.69 v30.78,35.53
  Bottom 0.152: v40.13,35.77 35.03,35.77 35.06,35.77 v35.14,35.69 | v44.78,31.93 45.16,31.93 46,32.77 47.62,32.77 47.69,32.85 49.34,32.85 49.48,32.99 49.94,32.99 50.36,32.57 v50.63,32.57 | v11.73,37.87 11.83,37.97 24.7,37.97 24.78,38.05 28.28,38.05 29.13,37.2 29.13,37.16 29.76,36.53 29.78,36.53 v30.78,35.53
GND  (via drill 0.35)
  Top 0.152: 23.39,46.22 C40.2 26.81,47.92 | 34.37,55.29 U4.48 | 34.37,55.29 34.35,55.29 | 31.57,51.04 U4.9 30.32,52.46 30.84,51.95 31.07,51.95 32.93,53.8 | 26.81,47.92 28,46.73 28.94,46.73 28.99,46.77 | 26.81,47.92 28.72,47.92 U4.14 29.49,48.64 30.22,49.37 30.22,49.58 30.83,50.2 30.88,50.2 v31.72,51.04 35.55,47.21 36.13,47.21 36.8,46.55 U4.29 36.88,46.52 25MHZ.2 | B1.GND@2 65.02,13.38 | 65.02,13.38 C14.2 | 65.02,13.38 65.02,15.18 55.23,24.97 54.23,24.97 53.53,25.67 52.16,25.67 IC2.35 51.42,25.7 49.15,27.98 49.04,28.09 | IC2.5 49.15,33.53 C3.2 | 47.03,25.47 47.03,26.08 | IC2.THERMAL 47.03,26.08 | 32.93,53.8 32.93,53.93 U4.3 | 47.03,26.08 46.15,25.2 IC2.23 | Y4.2 39.79,28.67 39.03,29.42 39.03,29.43 39.02,29.44 39.03,29.46 39.03,30.31 39.17,30.45 41.06,30.45 42.65,28.85 45.03,28.85 IC2.15 47.65,28.7 IC2.THERMAL 50.65,29.7 IC2.43 53.2,29.7 54.18,30.68 v54.18,30.77 | 28.99,46.77 U4.16 | 28.99,46.77 29.5,46.77 30.04,46.23 30.57,46.23 U4.19 | C3.2 50.03,34.41 51.71,34.41 53.74,32.39 v53.74,32.08 | 32.93,53.8 34.37,55.25 34.37,55.29 | C3.2 50.13,34.51 v50.13,35.16 | v47.92,35.24 47.67,35.49 v46.19,35.49
  Top 0.2: X3.SPRT@1 5.77,42.37 C6.2 9.9,46.5 10.33,46.5 11.11,45.72 U2.2 11.53,45.75 11.53,46.03 11.68,46.18 12.69,46.18 C7.2 15.89,44.72 C8.2 16.88,44.71 C22.2 21.1,45.52 C21.2 23,45.52 R12.1 23.39,46.22 | v27.82,54.92 25.39,57.35 24.44,57.35 23.69,58.1 C37.2 | 31.57,51.04 v31.72,51.04 | 32.43,39.83 v32.43,40.18 C24.2 32.45,40.27 C23.2 C35.2 37.47,40.22 25MHZ.4 40.83,41.97 40.83,42.52 | 40.83,42.52 25MHZ.2 | 40.83,42.52 41.98,42.52 C36.2 44.03,42.02 v44.19,42.18 | C5.1 48.12,48.77 48.12,42.91 v48.19,42.84 49.16,41.87 50.77,41.87 51.12,41.52 U5.11 59.01,41.52 v59.39,41.91
  Top 0.305: C5.1 49.77,50.53 C4.2 50.8,51.89 B1.GND@0 B1.GND@1
  Top 0.508: IC2.THERMAL 48.93,27.98 49.15,27.98
  Bottom 0.152: 29.61,53.15 v31.72,51.04 | 53.93,31.89 v53.74,32.08 53.74,31.21 v54.18,30.77 | v47.92,35.24 48.97,35.24 49,35.21 50.07,35.21 v50.13,35.16 | v48.19,42.84 48.19,39.32 46.91,38.04 46.91,37.16 46.19,36.43 v46.19,35.49 | JP1.1 32.43,39.83 v32.43,40.18
  Bottom 0.2: 29.61,53.15 29.29,53.15 28.95,53.49 28.95,53.79 v27.82,54.92 | v44.19,42.18 47.52,42.18 v48.19,42.84 | v59.39,41.91 59.39,38.89 JP1.13
  other vias: 3.81,24.13 3.81,25.4 3.81,26.67 3.81,27.94 3.81,29.21 3.81,30.48 5.08,30.48 5.08,29.21 5.08,27.94 5.08,26.67 5.08,25.4 5.08,24.13 5.08,22.86 6.35,22.86 6.35,24.13 6.35,25.4 7.62,25.4 6.35,26.67 6.35,27.94 6.35,29.21 6.35,30.48 7.62,30.48 7.62,31.75 7.62,33.02 8.89,33.02 8.89,31.75 8.89,30.48 8.89,29.21 7.62,29.21 7.62,27.94 8.89,27.94 7.62,26.67 8.89,26.67 8.89,25.4 10.16,25.4 10.16,24.13 8.89,24.13 7.62,24.13 7.62,22.86 8.89,22.86 10.16,22.86
  pour Top: 2.54,15.24 2.54,73.66 95.25,73.66 95.25,-2.54 25.4,-2.54 25.4,15.24 29.21,15.24 29.21,35.56 11.43,35.56 11.43,21.59 6.35,21.59 6.35,15.24
  pour Bottom: 2.54,15.24 2.54,34.29 11.43,34.29 11.43,21.59 6.35,21.59 6.35,15.24
INT
  Top 0.152: U4.36 41.43,49 R3.1
LNKLED  (via drill 0.35)
  Top 0.152: v21.96,48.92 21.11,49.76 14.99,49.76 14.42,50.32 13.24,50.32 11.99,49.08 9.96,49.08 9.28,49.76 X1.13 | v28.25,50.43 26.76,48.94 v24.22,48.94 | 35.39,45.2 U4.25 34.77,45.73 34.77,45.97 v31.65,49.09
  Bottom 0.152: v28.25,50.43 28.47,50.21 31.26,50.21 31.28,50.2 31.29,50.2 31.62,49.87 31.62,49.41 31.61,49.4 31.61,49.38 31.65,49.34 v31.65,49.09 | v21.96,48.92 21.98,48.94 v24.22,48.94
MISO  (via drill 0.35)
  Top 0.152: v50.19,47.41 51.58,47.41 U5.20 | 46.13,31.15 IC2.11 46.15,31.34 41.1,36.4 39.02,36.4 JP1.4 37.82,35.18 37.96,35.03 37.96,34.57 35.2,31.8 B1.MISO
  Bottom 0.152: v50.19,47.41 49.1,47.41 48.74,47.05 48.74,46.9 47.3,45.46 46.84,45.46 46.76,45.54 42.15,45.54 42.1,45.48 40.87,45.48 37.8,42.41 37.8,37.62 JP1.4
MISO_WIZ
  Top 0.152: U5.1 39.48,47.37 U4.34
MOSI  (via drill 0.35)
  Top 0.152: v49.29,46.82 50.01,46.82 50.76,46.08 U5.18 | IC2.10 46.65,31.52 46.51,31.67 40.58,37.6 JP1.5 39.33,37.6 38.26,38.67 37.38,38.67 36.75,38.04 36.75,36.97 36.03,36.25 30.71,36.25 29.97,35.51 27.32,35.51 26.15,34.34 B1.MOSI
  Bottom 0.152: JP1.5 40.36,43.32 42.2,45.15 47.42,45.15 47.5,45.23 47.7,45.23 v49.29,46.82
MOSI_WIZ  (via drill 0.35)
  Top 0.152: v47.07,46.02 45.85,46.02 U5.3 | U4.35 38.96,48.64 39.5,48.11 44.98,48.11 v45.09,48
  Bottom 0.152: v45.09,48 v47.07,46.02
N$1  (via drill 0.35)
  Bottom 0.508: v10.16,10.16 2.54,10.16 1.27,11.43 1.27,50.8 2.87,52.4 4.31,52.4 5.5,53.59 15.62,53.59 17.13,52.09 X1.1
  other vias: 10.16,16.51 11.43,16.51 12.7,16.51 10.16,15.24 11.43,15.24 12.7,15.24 12.7,13.97 11.43,13.97 10.16,13.97 13.97,13.97 15.24,13.97 16.51,13.97 13.97,12.7 15.24,12.7 16.51,12.7 16.51,11.43 15.24,11.43 13.97,11.43 10.16,12.7 11.43,12.7 12.7,12.7 11.43,11.43 12.7,11.43 12.7,10.16 11.43,10.16 10.16,8.89 11.43,8.89 12.7,8.89 15.24,6.35 16.51,6.35 15.24,5.08 16.51,5.08 13.97,10.16 15.24,10.16 16.51,10.16 13.97,8.89 15.24,8.89 16.51,8.89 16.51,7.62 15.24,7.62 13.97,7.62 17.78,10.16 19.05,10.16 20.32,10.16 17.78,8.89 19.05,8.89 20.32,8.89 20.32,7.62 19.05,7.62 17.78,7.62 17.78,13.97 19.05,13.97 20.32,13.97 17.78,12.7 19.05,12.7 20.32,12.7 20.32,11.43 19.05,11.43 17.78,11.43 21.59,13.97 22.86,13.97 21.59,12.7 22.86,12.7 22.86,11.43 21.59,11.43 17.78,6.35 19.05,6.35 20.32,6.35 17.78,5.08 19.05,5.08 20.32,5.08 21.59,6.35 22.86,6.35 21.59,5.08 22.86,5.08 21.59,10.16 22.86,10.16 21.59,8.89 22.86,8.89 22.86,7.62 21.59,7.62 10.16,11.43
  pour Top: 8.89,17.78 8.89,2.54 24.13,2.54 24.13,15.24 13.97,15.24 13.97,17.78
  pour Bottom: 8.89,17.78 8.89,2.54 24.13,2.54 24.13,15.24 13.97,15.24 13.97,17.78
N$2
  Top 0.508: U$1.VIN+2 U$1.VIN+1 0.51,9.46 0.51,53.85 1.27,54.61 16.51,54.61 18.8,52.33 X1.2
N$6
  Top 0.152: R5.2 8.49,36.37 X3.D+
N$9
  Top 0.2: X1.11 8.77,64.69 11.19,64.69 11.78,65.28 R1.2
N$10
  Top 0.2: R2.2 5.82,47.55 X1.14
N$11
  Top 0.152: Y4.3 41.13,29.87 42.83,28.17 45.15,28.17 IC2.16
N$12
  Top 0.152: IC2.17 42.38,27.7 42.29,27.79 40.44,27.79 Y4.1
N$13
  Top 0.152: R4.2 8.11,37.02 X3.D-
N$18  (via drill 0.35)
  Top 0.152: C21.1 21.49,47.66 v21.67,47.84 | v26.77,45.24 30.29,45.24 U4.20
  Bottom 0.152: v26.77,45.24 25.28,46.73 23.01,46.73 21.9,47.84 v21.67,47.84
N$19
  Top 0.152: C22.1 19.95,45.52 21.04,44.43 30.89,44.43 U4.22
N$20  (via drill 0.35)
  Top 0.152: R12.2 25.14,45.9 v26.3,47.06 | U4.10 29.8,51.99 v30.67,51.12
  Bottom 0.152: v30.67,51.12 26.3,51.12 25.18,50 | 25.18,50 25.18,49.92 | 25.18,49.92 25.18,48.18 v26.3,47.06 | 25.18,49.92 25.18,50
N$23
  Top 0.152: C40.1 23.39,48.6 22.79,49.2 22.75,49.2 22.62,49.33 22.62,51.17 R21.1 R22.1
N$25  (via drill 0.35)
  Top 0.152: 25MHZ.3 38.01,42.57 C35.1 36.92,42.47 v36.39,42.48 | v35.21,48.64 36.1,48.64 U4.31
  Bottom 0.152: v36.39,42.48 35.21,43.71 v35.21,48.64
N$26  (via drill 0.35)
  Top 0.152: C36.1 42.37,40.22 25MHZ.1 40.55,40.22 39.72,39.39 37.08,39.39 37.06,39.37 36.23,39.37 v36.16,39.44 | v35.9,47.88 36.15,47.88 U4.30
  Bottom 0.152: v36.16,39.44 36.16,41.41 36.99,42.25 36.99,42.7 36.23,43.46 36.23,47.54 v35.9,47.88
RD+  (via drill 0.35)
  Bottom 0.152: C38.2 19.93,49.95 18.34,51.54 18.34,56.41 17.13,57.63 X1.7
  other vias: 23.4,49.92
RD-
  Top 0.152: X1.5 17.21,56.06 C39.2
RDN
  Top 0.152: R22.2 28.35,54.01 29.21,54.86 30.58,54.86 U4.5
  Top 0.2: R22.2 C39.1
RDP
  Top 0.152: R21.2 26.95,51.97 29.39,54.4 30.33,54.4 U4.6
  Top 0.2: R21.2 25.11,49.96 C38.1
RST  (via drill 0.35)
  Top 0.152: B1.RES 68.3,49.81 JP1.16 68.3,35.6 64.02,31.32 53.17,31.32 v53.12,31.37 | IC2.13 45.74,29.7 46.08,30.04 46.08,30.15 46.16,30.23 | 46.16,30.23 46.23,30.3 51.08,30.3 51.23,30.45 51.43,30.45 51.82,30.85 v51.94,30.85 | v31.5,36.8 31.27,37.04 31.27,38.04 30.64,38.67 29.76,38.67 27.97,36.88 B1.RST_ICSP | v31.89,29.98 32.23,30.33 34.58,30.33 37.2,32.94 42.53,32.94 44.82,30.65 45.75,30.65 46.16,30.23
  Bottom 0.152: v51.94,30.85 52.56,30.81 v53.12,31.37 | v31.5,36.8 31.89,36.42 v31.89,29.98
SCK  (via drill 0.35)
  Top 0.152: U5.17 51.59,45.46 50.73,45.46 49.99,46.2 v49.81,46.2 | IC2.9 47.15,31.53 46.88,31.81 46.84,31.81 43.52,35.13 v43.52,35.93 v43.51,35.94 42.9,36.55 JP1.6 | v41.06,33.66 37.49,33.66 34.46,30.63 27.32,30.63 26.63,31.32 26.63,32.28 27.8,33.45 B1.SCK
  Bottom 0.152: v49.81,46.2 49.76,46.2 48.41,44.85 42.89,44.85 42.7,44.66 42.7,37.8 JP1.6 | v41.06,33.66 43.33,35.94 v43.51,35.94
SCK_WIZ
  Top 0.152: U5.4 43.98,45.42 42.58,46.82 39.32,46.82 U4.33
SCSN  (via drill 0.35)
  Top 0.152: v54.23,40.54 44.8,40.54 44.33,40.07 44.33,34.85 44.4,34.78 47.51,31.67 47.51,31.32 IC2.8 | U5.16 v52.93,44.77
  Bottom 0.152: v54.23,40.54 52.93,41.84 v52.93,44.77
SCSN_WIZ
  Top 0.152: U5.5 44,44.77 42.35,46.42 39.02,46.42 U4.32
TDN  (via drill 0.35)
  Top 0.152: 32.52,55.75 U4.1 31.94,56.34 v29.17,56.34 | X1.9 17.47,60.88 20.06,60.88 20.79,60.14 R20.1 23.39,59.6 v23.9,59.09
  Bottom 0.152: v23.9,59.09 24.38,59.09 26.02,57.44 28.07,57.44 v29.17,56.34
TDP  (via drill 0.35)
  Top 0.152: R19.1 19.98,62.18 X1.10 | v31,55.72 32.06,55.5 U4.2
  Bottom 0.152: X1.10 20.93,61.23 24.13,61.23 26.58,58.78 27.2,58.78 27.46,58.52 28.2,58.52 v31,55.72
VBUS  (via drill 0.35)
  Top 0.152: IC2.7 48.13,31.2
  Top 0.2: C6.1 8.19,43.29 | 8.19,43.29 10.16,45.25 U2.3 10.58,44.9 10.58,44.62 10.73,44.47 11.49,44.47 11.63,44.62 11.63,44.9 U2.1 | X3.VBUS 6.04,37.67 8.19,39.83 8.19,43.29
  Top 0.203: v48.05,31.99 48.05,31.95 48.23,31.77 48.23,31.25 IC2.7
  Top 0.254: C6.1 11.81,39.63 SJ1.1 15.55,31.75 R6.2 | v57.03,40.27 56.72,39.96 56.72,37.14 53.47,33.89 v53.06,33.89 | v53.43,56.57 53.43,59.6 B1.5V
  Top 0.305: v30.13,15.27 27.45,15.27 U$1.V+1 | B1.VIN 47.29,61.26 51.65,61.26 53.31,59.6 53.43,59.6
  Bottom 0.203: 52.98,17.02 JP3.3
  Bottom 0.254: v57.03,40.27 57.03,52.97 v53.43,56.57 | 48.13,27.87 48.05,27.95 v48.05,31.99 48.57,31.47 50.43,31.47 51.74,32.78 51.95,32.78 v53.06,33.89
  Bottom 0.305: 48.13,27.87 52.98,23.02 JP3.3 52.82,17.27 48.49,12.94 46.97,12.94 44.64,15.27 v30.13,15.27
  other vias: 21.59,21.13 15.24,22.86 15.24,24.13 15.24,25.4 16.51,25.4 16.51,26.67 16.51,27.94 16.51,29.21 16.51,22.86 16.51,24.13 17.78,22.86 17.78,24.13 17.78,25.4 17.78,26.67 17.78,27.94 17.78,29.21 17.78,30.48 17.78,31.75 17.78,33.02 19.05,33.02 19.05,31.75 19.05,30.48 19.05,29.21 19.05,27.94 19.05,26.67 19.05,25.4 19.05,24.13 20.32,24.13 20.32,25.4 20.32,26.67 20.32,27.94 20.32,29.21 20.32,30.48 20.32,31.75 20.32,33.02 21.59,33.02 21.59,31.75 21.59,30.48 21.59,29.21 21.59,27.94 21.59,26.67 21.59,25.4 21.59,24.13 22.86,20.32 22.86,21.59 22.86,22.86 22.86,24.13 22.86,25.4 22.86,26.67 22.86,27.94 22.86,29.21 22.86,30.48 22.86,31.75 22.86,33.02 24.13,29.21 24.13,27.94 24.13,26.67 24.13,25.4 24.13,24.13 24.13,22.86 24.13,21.59 24.13,20.32 25.4,20.32 25.4,21.59 25.4,22.86 25.4,24.13 25.4,25.4 25.4,26.67 25.4,27.94 25.4,29.21 26.67,20.32 26.67,21.59 26.67,22.86 26.67,24.13 26.67,25.4 26.67,26.67 26.67,27.94 26.67,29.21
  pour Top: 13.97,21.59 13.97,34.29 23.95,34.29 24.13,34.29 24.13,33.02 26.67,33.02 26.67,30.48 27.94,30.48 27.94,19.05 17.78,19.05 17.78,21.59
  pour Bottom: 13.97,21.59 13.97,34.29 23.95,34.29 23.95,33.2 24.13,33.02 26.67,33.02 26.49,30.48 27.94,30.48 27.94,19.05 17.78,19.05 17.78,21.59
VCC-ISO  (via drill 0.35)
  Top 0.152: U5.19 51.68,46.77 51.78,46.67 v52.81,46.67 | IC2.34 IC2.33 51.15,24.62 50.84,24.93 46.72,24.93 46.65,24.86 IC2.24 | 48.17,34.26 45.84,34.26 v45.23,34.87 | 48.17,34.26 C3.1 48.19,34.73 v49.23,35.77 | v53.15,30.45 52.91,30.2 IC2.44 52.2,30.28 52.35,30.28 52.66,30.59 52.66,31.03 52.56,31.13 52.56,32.39 51.57,33.38 v50.92,33.38 | IC2.6 48.65,32.98 v48.23,33.41 48.17,33.47 48.17,34.26
  Top 0.2: 51.68,46.77 51.87,46.97 52.22,46.97 52.37,47.12 52.37,47.63 52.22,47.78 50.81,47.78 C5.2 | 24.23,39.62 SJ1.2 | IC2.14 44.08,29.2 | 44.08,29.2 v41.26,32.03 | 44.08,29.2 44.17,29.29 v44.17,29.99 | IC2.24 46.65,23.69 46.23,23.27 v44.5,23.27
  Top 0.61: SJ1.2 v24.13,40.64
  Bottom 0.152: 49.34,35.88 v49.23,35.77 49.45,35.99 49.45,38.04 49.93,38.52 49.93,39.77 52.37,42.21 52.37,45 52.81,45.44 v52.81,46.67 | v50.92,33.38 50.89,33.41 v48.23,33.41
  Bottom 0.2: v45.23,34.87 44.13,34.87 41.83,32.57 41.8,32.57 v41.26,32.03 | v44.17,29.99 44.5,29.66 v44.5,23.27
  pour Bottom: 16.51,77.47 16.51,35.56 29.21,35.56 29.21,17.78 25.4,17.78 25.4,-1.27 100.33,-1.27 100.33,77.47
VCCA  (via drill 0.35)
  Top 0.152: v27.56,48.51 29.59,50.54 29.61,50.54 29.96,50.88 29.96,51.07 29.45,51.58 U4.11 29.45,51.93 28.93,52.44 28.93,53.05 v29.67,53.79 29.67,53.65 U4.8 | v28.23,47.28 28.79,47.28 U4.15 29.97,48.29 30.48,48.8 30.67,48.8 31.02,48.45 31.02,48.44 31.08,48.38 31.08,48.15 30.63,47.7 | R19.2 25.13,62.18 | C37.1 25.2,58 v26.25,58 26.25,57.58 v28.63,55.21 30.73,55.21 30.77,55.17 30.98,55.17 U4.4 | 30.63,47.7 U4.17 30.68,47.58 30.8,47.7 | 31.39,48.09 32.45,47.04 32.45,46.69 U4.21 | R3.2 40.71,49.97 v34.34,49.97 | 30.8,47.7 31.19,48.09 31.39,48.09 | 30.8,47.7 30.63,47.7 | v31.56,48.27 31.39,48.09
  Top 0.2: R19.2 25.13,62.18 | C37.1 R20.2 25.09,62.16 R19.2 C9.1 C10.1 25.1,66.28 C25.1 25.11,68.33 L2.2
  Bottom 0.152: v27.56,48.51 27.56,47.95 v28.23,47.28 | v28.63,55.21 28.63,54.83 v29.67,53.79 | v34.34,49.97 32.63,48.27 v31.56,48.27
WIZ_RST  (via drill 0.35)
  Top 0.152: U5.15 50.85,44.12 50.47,43.74 v50.47,42.45 | IC2.22 44.69,24.71 v43.22,24.71
  Bottom 0.152: v50.47,42.45 49.05,41.03 49.05,38.04 49.05,37.16 48.42,36.53 | 48.42,36.53 | v43.22,24.71 43.22,29.16 42.22,30.16 42.22,31.28 44.45,33.5 45.39,33.5 47.69,35.8 48.42,36.53
WIZ_RST_WIZ  (via drill 0.35)
  Top 0.152: U5.6 40.18,44.12 v38.17,46.14 | v37.15,50.79 38.66,50.79 U4.37
  Bottom 0.152: v38.17,46.14 38.17,49.77 v37.15,50.79

### Text on the board
Document: + | + | + | + | + | +
tDocu: A5 | A4 | A3 | A2 | A1 | A0 | 9 | 10 | 11 | 12 | 13 | 0 | 1 | 2 | 3 | 4 | 5 | 6 | 7 | 8